# EAGLE design drum_circuits_noMIC (EAGLE 7.5.0)
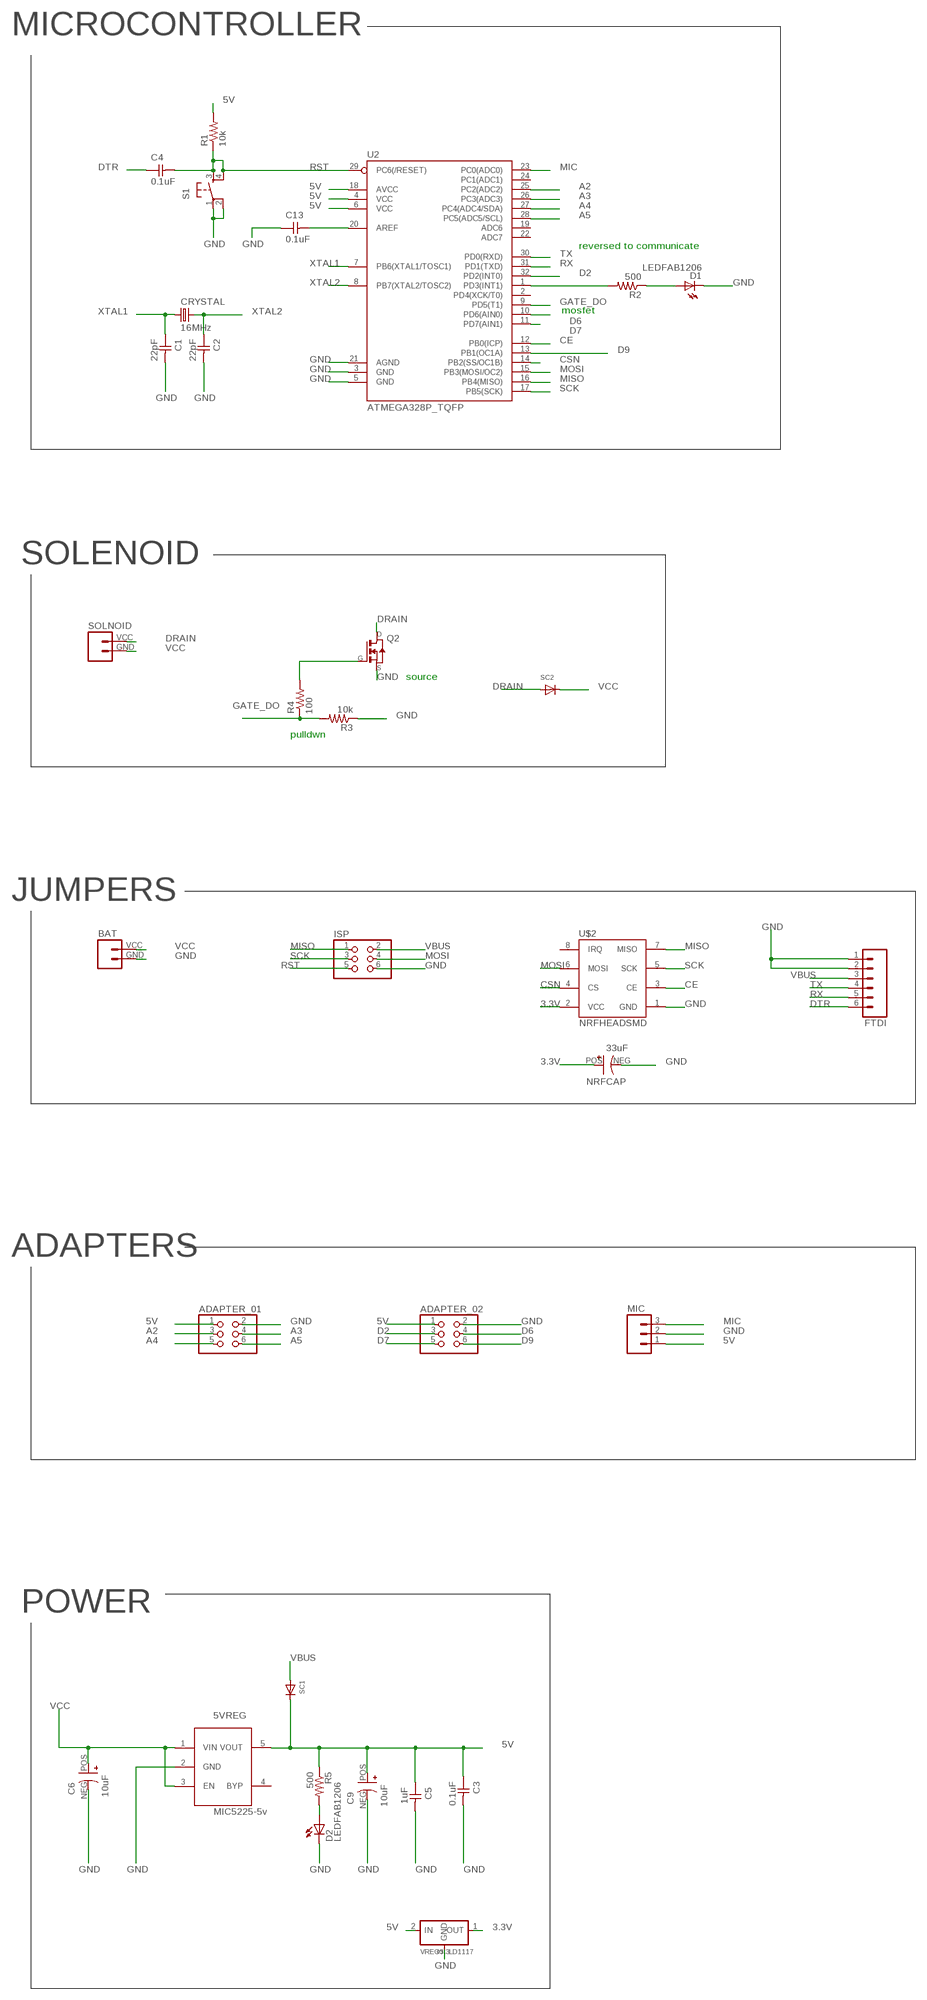
[diagram p0: schematic, sheet 1]

## Parts
5VREG  MIC5225-5v  LP298XS  [SOT23-5L]
ADAPTER_01  PINHD-2X3-SMD  [2X03SMD]
ADAPTER_02  PINHD-2X3-SMD  [2X03SMD]
BAT  M024UCON-15767  [JST-2-SMD-VERT]
C1  22pF  CAP-UNPOLARIZEDFAB  [C1206FAB]
C2  22pF  CAP-UNPOLARIZEDFAB  [C1206FAB]
C3  0.1uF  CAP-UNPOLARIZEDFAB  [C1206FAB]
C4  0.1uF  CAP-UNPOLARIZEDFAB  [C1206FAB]
C5  1uF  CAP-UNPOLARIZEDFAB  [C1206FAB]
C6  10uF  POLCAP-PANASONIC-SMD-B01  [PANASONIC-CAP-SMD-B]
C9  10uF  POLCAP-PANASONIC-SMD-B01  [PANASONIC-CAP-SMD-B]
C13  0.1uF  CAP-UNPOLARIZEDFAB  [C1206FAB]
CRYSTAL  16MHz  CRYSTAL  [2-SMD-5X3MM]
D1  LEDFAB1206  [LED1206FAB]
D2  LEDFAB1206  [LED1206FAB]
FTDI  M06SMD_MALE  [1X06_SMD_MALE]
ISP  PINHD-2X3-SMD  [2X03SMD]
MIC  M03  [JST-3-SMD]
NRFCAP  33uF  POLCAP-PANASONIC-SMD-C  [PANASONIC-CAP-SMD-C]
Q2  NMOSFETSOT23  [SOT-23]
R1  10k  RES-US1206FAB  [R1206FAB]
R2  500  RES-US1206FAB  [R1206FAB]
R3  10k  RES-US1206FAB  [R1206FAB]
R4  100  RES-US1206FAB  [R1206FAB]
R5  500  RES-US1206FAB  [R1206FAB]
S1  6MM_SWITCH6MM_SWITCH  [6MM_SWITCH]
SC1  DIODE_SOD-123FL  [SOD-123FL]
SC2  DIODE_SOD-123FL  [SOD-123FL]
SOLNOID  M024UCON-15767  [JST-2-SMD-VERT]
U2  ATMEGA328P_TQFP  [TQFP32-08]
U$2  NRFHEADSMD  [2.54MM]
VREG3.3  LD1117  REGULATORSOT23  [SOT23]

## Nets
3.3V: NRFCAP.POS(+) U$2.2(VCC) VREG3.3.1(OUT)
5V: 5VREG.5(VOUT) ADAPTER_01.1 ADAPTER_02.1 C3.1 C5.1 C9.POS(+) MIC.1 R1.2 R5.1 SC1.C U2.4(VCC) U2.6(VCC) U2.18(AVCC) VREG3.3.2(IN)
A2: ADAPTER_01.3 U2.25(PC2(ADC2))
A3: ADAPTER_01.4 U2.26(PC3(ADC3))
A4: ADAPTER_01.5 U2.27(PC4(ADC4/SDA))
A5: ADAPTER_01.6 U2.28(PC5(ADC5/SCL))
CE: U2.12(PB0(ICP)) U$2.3(CE)
CSN: U2.14(PB2(SS/OC1B)) U$2.4(CS)
D2: ADAPTER_02.3 U2.32(PD2(INT0))
D6: ADAPTER_02.4 U2.10(PD6(AIN0))
D7: ADAPTER_02.5 U2.11(PD7(AIN1))
D9: ADAPTER_02.6 U2.13(PB1(OC1A))
DRAIN: Q2.1(D) SC2.A SOLNOID.VCC
DTR: C4.1 FTDI.6
GATE_DO: R3.2 R4.1 U2.9(PD5(T1))
GND: 5VREG.2(GND) ADAPTER_01.2 ADAPTER_02.2 BAT.GND C1.2 C2.2 C3.2 C5.2 C6.NEG(-) C9.NEG(-) C13.1 D1.2(C) D2.2(C) FTDI.1 FTDI.2 ISP.6 MIC.2 NRFCAP.NEG(-) Q2.2(S) R3.1 S1.1(P) S1.2(P1) U2.3(GND) U2.5(GND) U2.21(AGND) U$2.1(GND) VREG3.3.3(GND)
MIC: MIC.3 U2.23(PC0(ADC0))
MISO: ISP.1 U2.16(PB4(MISO)) U$2.7(MISO)
MOSI: ISP.4 U2.15(PB3(MOSI/OC2)) U$2.6(MOSI)
N$1: D1.1(A) R2.1
N$6: D2.1(A) R5.2
N$9: C13.2 U2.20(AREF)
N$10: R2.2 U2.1(PD3(INT1))
N$11: Q2.3(G) R4.2
RST: C4.2 ISP.5 R1.1 S1.3(S) S1.4(S1) U2.29(PC6(/RESET))
RX: FTDI.5 U2.31(PD1(TXD))
SCK: ISP.3 U2.17(PB5(SCK)) U$2.5(SCK)
TX: FTDI.4 U2.30(PD0(RXD))
VBUS: FTDI.3 ISP.2 SC1.A
VCC: 5VREG.1(VIN) 5VREG.3(EN) BAT.VCC C6.POS(+) SC2.C SOLNOID.GND
XTAL1: C1.1 CRYSTAL.P$1 U2.7(PB6(XTAL1/TOSC1))
XTAL2: C2.1 CRYSTAL.P$2 U2.8(PB7(XTAL2/TOSC2))
Unconnected: 5VREG.4(BYP) U2.2(PD4(XCK/T0)) U2.19(ADC6) U2.22(ADC7) U2.24(PC1(ADC1)) U$2.8(IRQ)

## Notes on the sheet
- MICROCONTROLLER
- reversed to communicate
- mosfet
- SOLENOID
- source
- pulldwn
- JUMPERS
- ADAPTERS
- POWER

## Library data of the parts
5VREG = adafruit:LP298X
ADAPTER_01 ADAPTER_02 ISP = fab:PINHD-2X3-SMD: PIN HEADER
BAT SOLNOID = SparkFun-Connectors:M02: Standard 2-pin 0.1" header. Use with - straight break away headers ( PRT-00116) - right angle break away headers (PRT-00553) - swiss pins (PRT-00743) - machine pins (PRT-00117) - female headers (PRT-00115) Molex polarized connector foot print use with: PRT-08233 with associated crimp pins and housings. 2.54_SCREWTERM for use with PRT-10571. 3.5mm Screw Terminal footprints for PRT-08084 5mm Screw Terminal footprints for use with PRT-08432
C1-C5 C13 = fab:CAP-UNPOLARIZED
C6 C9 = talkingdrums:POLCAP-PANASONIC-SMD-B
CRYSTAL = fab:CRYSTAL
D1 D2 = fab:LED: LED
FTDI = SparkFun-Connectors:M06: Header 6 Standard 6-pin 0.1" header. Use with straight break away headers (SKU : PRT-00116), right angle break away headers (PRT-00553), swiss pins (PRT-00743), machine pins (PRT-00117), and female headers (PRT-00115). Molex polarized connector foot print use with SKU : PRT-08094 with associated crimp pins and housings. NOTES ON THE VARIANTS LOCK and LOCK_LONGPADS... This footprint was designed to help hold the alignment of a through-hole component (i.e. 6-pin header) while soldering it into place. You may notice that each hole has been shifted either up or down by 0.005 of an inch from it's more standard position (which is a perfectly straight line). This slight alteration caused the pins (the squares in the middle) to touch the edges of the holes. Because they are alternating, it causes a "brace" to hold the component in place. 0.005 has proven to be the perfect amount of "off-center" position when using our standard breakaway headers. Although looks a little odd when you look at the bare footprint, once you have a header in there, the alteration is very hard to notice. Also,if you push a header all the way into place, it is covered up entirely on the bottom side. This idea of altering the position of holes to aid alignment will be further integrated into the Sparkfun Library for other footprints. It can help hold any component with 3 or more connection pins.; PROD_ID: CONN-11293
MIC = SparkFun:M03: Header 3 Standard 3-pin 0.1" header. Use with straight break away headers (SKU : PRT-00116), right angle break away headers (PRT-00553), swiss pins (PRT-00743), machine pins (PRT-00117), and female headers (PRT-00115). Molex polarized connector foot print use with SKU : PRT-08232 with associated crimp pins and housings.
NRFCAP = talkingdrums:POLCAP-PANASONIC-SMD-C
Q2 = fab:NMOSFET: MOS FET
R1-R5 = fab:RES-US: Resistor (US Symbol) Variants with postfix FAB are widened to allow the routing of internal traces
S1 = fab:6MM_SWITCH: OMRON SWITCH
SC1 SC2 = adafruit:DIODE: Diode SMADIODE - SMA Surface Mount Package 20V 1A Schottky Diode Digikey: 641-1014-6-ND DO-1N4148 - Through Hole Small Current Diode SOD-123 20V 1 A (.5mV Vf) Schottky Diode - Digikey: MBRX120TPMSCT-ND SOD-323 10V 570mA (.38mV Vf, 3ns) Schottky Diode - Digikey: ZLLS410CT-ND SOD-523 30V 30mA Schottky Diode (RB751S-40TE61) - Digikey: RB751S-40TE61CT-ND SOT23-R/W - SOT23 Package (R = Solder Paste/Reflow Ovens, W = Hand-Soldering) BAT54Film 40V 300mA - Digikey: 497-7162-1-ND
U2 = SparkFun-DigitalIC:ATMEGA328P_TQFP; PROD_ID: IC-09069
U$2 = nrf:NRFHEAD
VREG3.3 = fab:REGULATOR

## Board
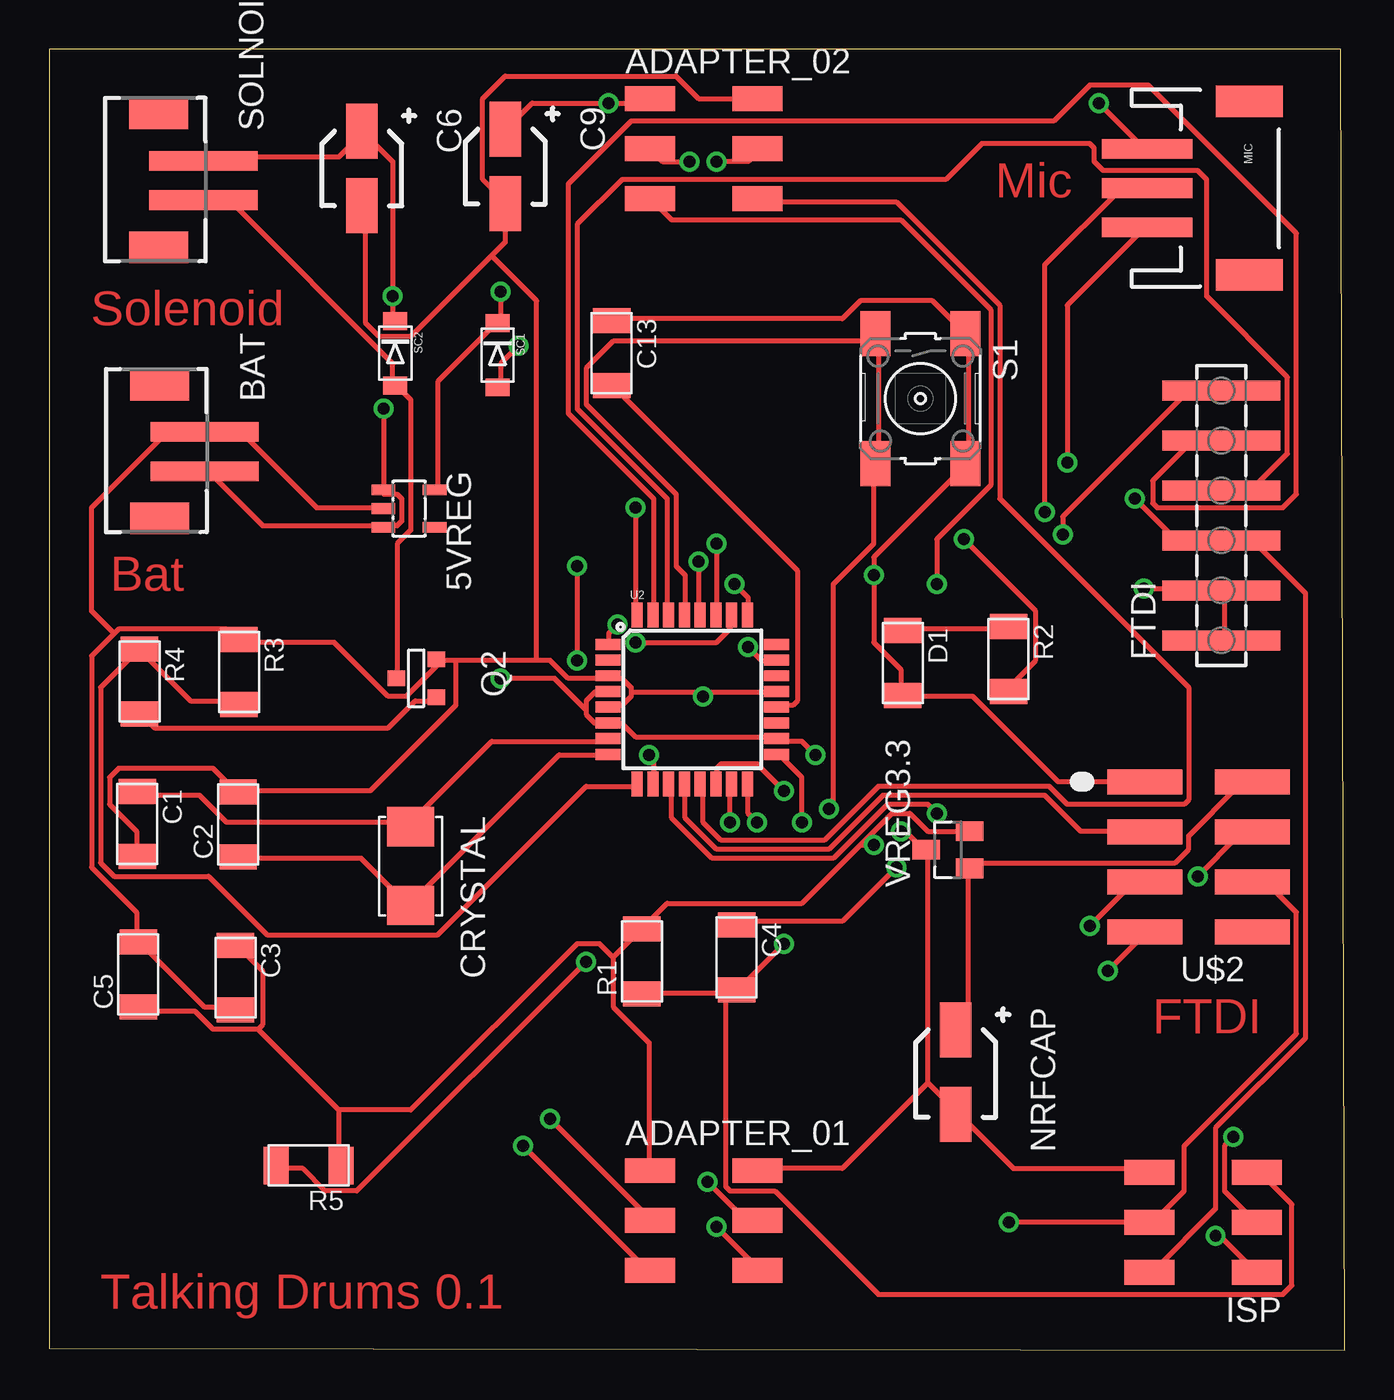
[diagram p1: board, top side]
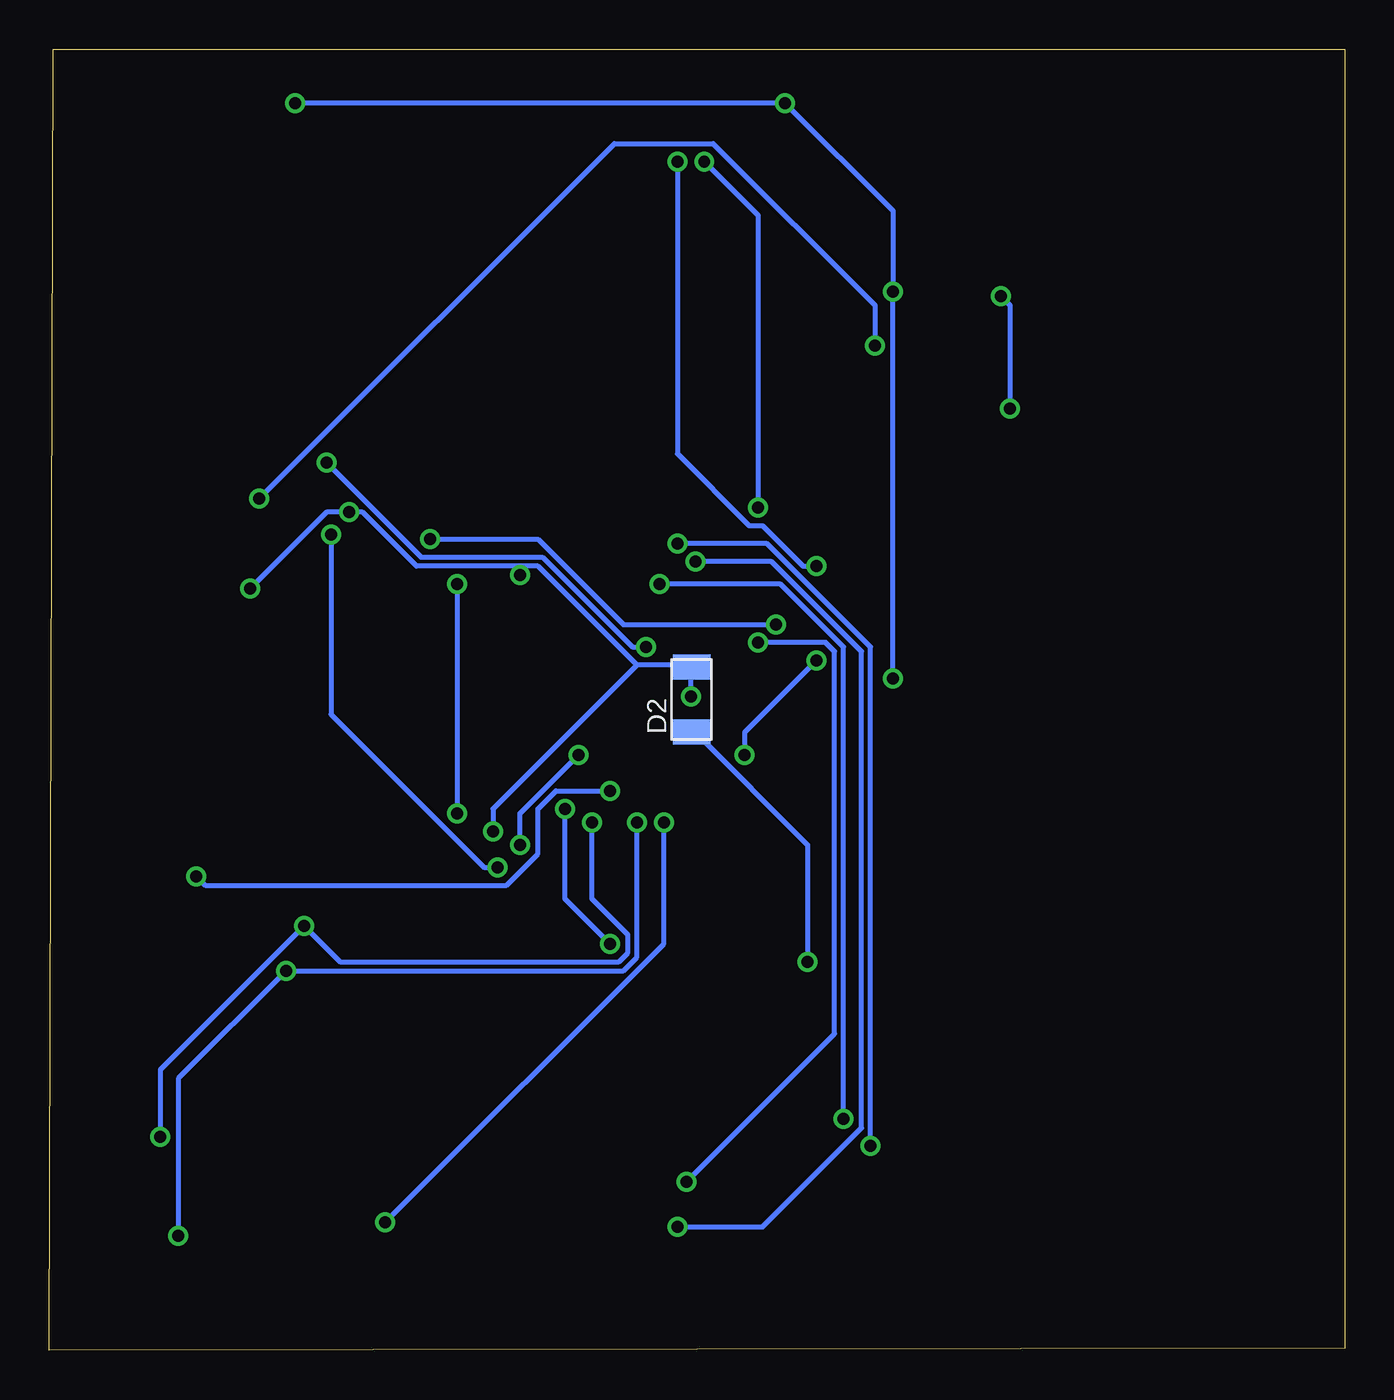
[diagram p2: board, bottom side, seen from below]

Size 65.87 x 66.16 mm. Coordinates in mm from the lower left corner, seen from the top.
Outline: 0,0.1 65.87,0 65.67,66.16 0,66.16 0,0.1
Copper layers (1*16): Top 0.035mm / dielectric 1.5mm / Bottom 0.035mm
Design rules "default": minimum track width 10mil, minimum drill 24mil, track to track 8mil, track to pad 8mil, pad to pad 8mil, via to via 8mil, smd to smd 8mil, copper to edge 40mil, drill to drill 8mil, minimum pad ring 10mil, minimum via ring 8mil, stop-mask expansion 4mil, vias tented up to drill 0mil, thermal gap 10mil

### Footprints (pad centres in the part's own frame; a part is rotated, then mirrored left to right if it is on the bottom)
SOT23-5L = smd 0.55 x 1.2: 1 -0.95,-1.3; 2 0,-1.3; 3 0.95,-1.3; 4 0.95,1.3; 5 -0.95,1.3
2X03SMD = smd 2.54 x 1.27: 1 -2.54,2.54; 2 2.92,2.54; 3 -2.54,0; 4 2.92,0; 5 -2.54,-2.54; 6 2.92,-2.54
JST-2-SMD-VERT = smd 1 x 5.5: GND 1,-2; VCC -1,-2 | smd 1.6 x 3: P$1 -3.4,0.27; P$2 3.4,0.27
C1206FAB = smd 1.27 x 1.905: 1 -1.651,0; 2 1.651,0
PANASONIC-CAP-SMD-B = smd 1.6 x 2.794: NEG 0,3.794; POS 0,0
2-SMD-5X3MM = smd 2 x 2.4: P$1 -2,0; P$2 2,0
LED1206FAB = smd 1.27 x 1.905: 1 -1.651,0; 2 1.651,0
1X06_SMD_MALE = smd 1.02 x 6: 1 0,0; 2 2.54,0; 3 5.08,0; 4 7.62,0; 5 10.16,0; 6 12.7,0
JST-3-SMD = smd 1 x 4.6: 1 -1.99,-4.77; 2 0.01,-4.77; 3 2.01,-4.77 | smd 1.6 x 3.4: NC1 -4.39,0.43; NC2 4.41,0.43
PANASONIC-CAP-SMD-C = smd 1.6 x 2.794: NEG 0,4.294; POS 0,0
SOT-23 = smd 0.787 x 0.889: 1 0.025,-1.016; 2 -0.94,1.016; 3 0.991,1.016
R1206FAB = smd 1.27 x 1.905: 1 -1.651,0; 2 1.651,0
6MM_SWITCH = smd 2.286 x 1.524: 1 -3.302,2.286; 2 3.302,2.286; 3 -3.302,-2.286; 4 3.302,-2.286
SOD-123FL = smd 0.91 x 1.22: A 1.637,0; C -1.637,0
TQFP32-08 = smd 1.27 x 0.559: 1 -4.293,2.8; 2 -4.293,2; 3 -4.293,1.2; 4 -4.293,0.4; 5 -4.293,-0.4; 6 -4.293,-1.2; 7 -4.293,-2; 8 -4.293,-2.8; 17 4.293,-2.8; 18 4.293,-2; 19 4.293,-1.2; 20 4.293,-0.4; 21 4.293,0.4; 22 4.293,1.2; 23 4.293,2; 24 4.293,2.8 | smd 0.559 x 1.27: 9 -2.8,-4.293; 10 -2,-4.293; 11 -1.2,-4.293; 12 -0.4,-4.293; 13 0.4,-4.293; 14 1.2,-4.293; 15 2,-4.293; 16 2.8,-4.293; 25 2.8,4.293; 26 2,4.293; 27 1.2,4.293; 28 0.4,4.293; 29 -0.4,4.293; 30 -1.2,4.293; 31 -2,4.293; 32 -2.8,4.293
2.54MM = smd 3.81 x 1.27: 1 0,0; 2 -5.486,0; 3 0,2.54; 4 -5.486,2.54; 5 0,5.08; 6 -5.486,5.08; 7 0,7.62; 8 -5.486,7.62
SOT23 = smd 1 x 1.4: 1 -0.95,-1.1; 2 0.95,-1.1; 3 0,1.1

### Placement (x,y rotation side)
5VREG  18.3,42.8 270 top
ADAPTER_01  33.1,6.6 0 top
ADAPTER_02  33.1,61.1 0 top
BAT  5.9,45.7 90 top
C1  4.48,26.76 270 top
C2  9.61,26.74 90 top
C3  9.48,18.95 270 top
C4  34.95,19.99 270 top
C5  4.53,19.11 90 top
C6  15.9,62 180 top
C9  23.2,62.1 180 top
C13  28.6,50.7 270 top
CRYSTAL  18.38,24.62 270 top
D1  43.41,34.95 270 top
D2  33.2,33.1 90 bottom
FTDI  59.6,36.1 90 top
ISP  58.86,6.5 180 top
MIC  60.6,59.1 270 top
NRFCAP  46.1,16.3 180 top
Q2  18.66,34.19 270 top
R1  30.14,19.78 90 top
R2  48.78,35.14 270 top
R3  9.66,34.48 270 top
R4  4.6,34 270 top
R5  13.2,9.4 180 top
S1  44.3,48.4 270 top
SC1  22.8,50.6 270 top
SC2  17.6,50.7 270 top
SOLNOID  5.84,59.48 90 top
U2  32.7,33.1 0 top
U$2  55.7,28.9 180 top
VREG3.3  45.7,25.45 90 top

### Tracks (layer width: path | path; a pad name or v marks a point on that pad's centre or on a via)
3.3V
  Top 0.254: NRFCAP.POS 46.28,16.33 46.73,16.79 46.73,24.33 VREG3.3.1 46.96,24.56 47.19,24.79 57.25,24.79 57.94,25.48 57.94,26.16 60.45,28.68 61.14,28.68 U$2.2
5V  (via drill 0.61)
  Top 0.254: 5VREG.5 19.76,43.76 19.76,49.25 22.73,52.22 SC1.C 22.96,52.45 v22.96,53.82 | ADAPTER_02.1 30.5,63.42 v28.45,63.42 24.56,63.42 23.42,62.28 C9.POS | v53.36,63.42 55.65,61.14 MIC.1 | 10.62,16.33 8.33,16.33 7.42,17.25 4.67,17.25 C5.1 | 10.62,16.33 10.84,16.56 10.84,19.3 9.7,20.45 C3.1 | 14.73,12.22 14.73,9.47 R5.1 | 10.62,16.33 14.73,12.22 | 27.3,32.56 27.3,33.02 27.76,33.48 28.22,33.48 U2.4 | 27.3,32.56 27.3,32.33 27.76,31.88 28.22,31.88 U2.6 28.45,31.88 29.13,31.88 29.82,31.19 36.91,31.19 U2.18 37.13,30.96 38.28,30.96 v38.96,30.28 | 41.25,25.7 38.28,22.73 31.42,22.73 30.28,21.59 R1.2 30.05,21.36 28.68,19.99 | 41.25,25.7 42.85,27.3 43.76,27.3 44.68,26.39 46.73,26.39 VREG3.3.2 | 28.68,19.99 28.68,17.47 30.5,15.64 30.5,9.24 ADAPTER_01.1 | 41.25,25.7 v41.93,25.7 | 14.73,12.22 18.39,12.22 26.85,20.67 27.99,20.67 28.68,19.99 | v22.96,34.16 25.7,34.16 27.3,32.56
  Bottom 0.254: v53.36,63.42 v28.45,63.42 22.96,57.94 v22.96,53.82 v22.96,34.16 | v38.96,30.28 41.93,27.3 v41.93,25.7
A2  (via drill 0.61)
  Top 0.254: v34.85,38.96 35.53,38.28 35.53,37.59 U2.25 | v25.48,11.76 30.5,6.73 ADAPTER_01.3
  Bottom 0.254: v34.85,38.96 28.68,38.96 25.48,35.76 v25.48,11.76
A3  (via drill 0.61)
  Top 0.254: v29.82,35.99 33.93,35.99 34.62,36.68 34.62,37.36 U2.26 | v33.48,8.56 35.3,6.73 35.99,6.73 ADAPTER_01.4
  Bottom 0.254: v29.82,35.99 26.39,35.99 25.93,35.53 25.93,16.1 v33.48,8.56
A4  (via drill 0.61)
  Top 0.254: v33.93,41.02 33.93,37.59 U2.27 | v24.1,10.39 30.5,3.99 ADAPTER_01.5
  Bottom 0.254: v33.93,41.02 29.36,41.02 24.1,35.76 v24.1,10.39
A5  (via drill 0.61)
  Top 0.254: v33.02,40.11 33.02,37.59 U2.28 | v33.93,6.27 35.99,4.21 ADAPTER_01.6
  Bottom 0.254: v33.02,40.11 29.13,40.11 24.56,35.53 24.56,11.3 29.59,6.27 v33.93,6.27
CE
  Top 0.254: U2.12 32.33,28.68 32.33,27.08 33.93,25.48 39.65,25.48 42.39,28.22 50.62,28.22 52.45,26.39 55.65,26.39 U$2.3
CSN  (via drill 0.61)
  Top 0.254: v37.36,28.45 35.99,29.82 34.16,29.82 33.93,29.59 33.93,28.9 U2.14 | v58.39,24.1 60.45,26.16 61.14,26.16 U$2.4
  Bottom 0.254: v37.36,28.45 40.11,28.45 41.02,27.53 41.02,25.25 42.62,23.65 57.94,23.65 v58.39,24.1
D2  (via drill 0.61)
  Top 0.254: v29.82,42.85 29.82,37.59 U2.32 | v32.56,60.45 31.19,60.45 30.73,60.91 ADAPTER_02.3
  Bottom 0.254: v29.82,42.85 29.82,57.71 v32.56,60.45
D6  (via drill 0.61)
  Top 0.254: v30.5,30.28 30.73,30.05 30.73,28.9 U2.10 | v26.85,39.88 v26.85,35.08 | v33.93,60.45 35.53,60.45 35.99,60.91 ADAPTER_02.4
  Bottom 0.254: v30.5,30.28 30.5,31.42 v26.85,35.08 | v26.85,39.88 27.53,39.88 29.59,41.93 30.28,41.93 33.93,45.59 v33.93,60.45
D7  (via drill 0.61)
  Top 0.254: v45.13,27.3 44.68,27.76 42.62,27.76 39.88,25.02 33.7,25.02 31.65,27.08 31.65,28.68 U2.11 | v45.13,38.96 45.13,41.25 47.88,43.99 47.88,52.91 43.3,57.48 31.65,57.48 30.73,58.39 ADAPTER_02.5
  Bottom 0.254: v45.13,38.96 v45.13,27.3
D9
  Top 0.254: U2.13 33.25,28.68 33.25,26.85 34.16,25.93 39.42,25.93 42.16,28.68 50.85,28.68 51.76,27.76 57.71,27.76 57.94,27.99 57.94,33.7 48.34,43.3 48.34,53.13 43.08,58.39 36.22,58.39 ADAPTER_02.6
DRAIN
  Top 0.254: Q2.1 17.7,34.39 17.7,41.02 18.39,41.7 18.39,48.34 17.7,49.02 SC2.A 17.47,49.25 17.47,50.16 9.24,58.39 7.87,58.39 SOLNOID.VCC
DTR  (via drill 0.61)
  Top 0.254: v43.08,24.56 40.33,21.82 35.08,21.82 C4.1 | v51.54,41.48 51.54,42.39 57.94,48.79 59.54,48.79 FTDI.6
  Bottom 0.254: v43.08,24.56 43.76,24.56 51.54,32.33 v51.54,41.48
GATE_DO
  Top 0.254: U2.9 29.82,28.68 27.3,28.68 19.76,21.13 11.07,21.13 8.1,24.1 3.3,24.1 2.62,24.79 2.62,33.7 4.44,35.53 R4.1 4.67,35.53 7.19,33.02 9.47,33.02 R3.2
GND  (via drill 0.61)
  Top 0.254: U$2.1 55.65,28.9 51.31,28.9 46.96,33.25 43.53,33.25 D1.2 43.3,33.48 43.3,34.62 41.93,35.99 v41.93,39.42 41.93,40.33 46.51,44.91 S1.2 46.73,45.13 46.73,51.54 S1.1 46.51,51.76 44.91,53.36 41.25,53.36 40.33,52.45 28.68,52.45 C13.1 | 44.68,13.59 44.68,25.25 VREG3.3.3 44.45,25.48 43.53,26.39 v43.3,26.39 | 44.68,13.59 46.05,12.22 NRFCAP.NEG 46.28,11.99 49.02,9.24 55.88,9.24 ISP.6 | 44.68,13.59 40.33,9.24 36.22,9.24 ADAPTER_01.2 | ADAPTER_02.2 35.99,63.65 33.02,63.65 31.88,64.79 23.19,64.79 22.05,63.65 22.05,59.54 23.19,58.39 C9.NEG 23.19,58.16 23.19,56.34 22.5,55.65 | 22.5,55.65 18.39,51.54 16.79,51.54 16.1,52.22 16.1,58.16 C6.NEG | 5VREG.2 16.79,42.85 13.59,42.85 9.93,46.51 8.1,46.51 BAT.GND 7.87,46.51 5.81,46.51 2.16,42.85 2.16,37.59 3.3,36.45 | FTDI.1 59.77,36.22 59.77,38.51 FTDI.2 59.54,38.73 v55.65,38.73 | C1.2 4.44,25.25 4.44,26.39 3.07,27.76 3.07,29.13 3.53,29.59 8.33,29.59 9.47,28.45 C2.2 9.7,28.45 16.33,28.45 20.67,32.79 20.67,35.08 | C3.2 9.47,17.47 7.87,17.47 4.67,20.67 C5.2 4.44,20.9 4.44,22.27 2.16,24.56 2.16,35.3 3.3,36.45 | 24.79,35.08 25.48,35.08 26.39,34.16 28.22,34.16 U2.3 28.45,34.16 29.13,34.16 29.59,33.7 29.59,33.48 | 24.79,35.08 20.67,35.08 | 20.67,35.08 19.99,35.08 | 19.99,35.08 19.76,35.08 Q2.2 19.99,35.08 | 29.59,33.48 29.59,33.25 29.13,32.79 28.45,32.79 U2.5 | 29.59,33.48 33.25,33.48 | 33.25,33.48 36.91,33.48 U2.21 | 33.25,33.48 v33.25,33.25 | 19.99,35.08 18.16,33.25 17.25,33.25 14.5,35.99 9.7,35.99 R3.1 9.47,36.22 9.01,36.68 3.53,36.68 3.3,36.45 | v50.62,42.62 50.62,55.19 54.51,59.08 55.65,59.08 MIC.2 | 22.5,55.65 24.79,53.36 24.79,35.08
  Bottom 0.254: v33.25,33.25 33.25,34.62 D2.2 33.25,34.85 35.99,34.85 | 41.93,39.88 41.02,39.88 35.99,34.85 | 41.93,39.88 47.19,39.88 49.94,42.62 v50.62,42.62 51.76,42.62 v55.65,38.73 | v43.3,26.39 43.3,27.53 35.99,34.85 | 41.93,39.88 v41.93,39.42
MIC  (via drill 0.61)
  Top 0.254: v35.53,35.76 36.22,35.08 36.91,35.08 U2.23 | v51.76,45.13 51.76,53.13 55.65,57.02 MIC.3
  Bottom 0.254: v35.53,35.76 36.22,35.76 40.79,40.33 46.96,40.33 v51.76,45.13
MISO  (via drill 0.61)
  Top 0.254: v35.99,26.85 35.53,27.3 35.53,28.68 U2.16 | v53.82,19.3 55.65,21.13 U$2.7 | v59.31,5.81 59.54,5.81 61.37,3.99 ISP.1
  Bottom 0.254: v35.99,26.85 35.99,19.99 36.68,19.3 v53.82,19.3 59.31,13.82 v59.31,5.81
MOSI  (via drill 0.61)
  Top 0.254: v34.62,26.85 34.62,28.68 U2.15 | v48.79,6.5 55.88,6.5 ISP.4 56.11,6.5 57.71,8.1 57.71,10.39 63.42,16.1 63.42,22.27 62.05,23.65 61.37,23.65 U$2.6
  Bottom 0.254: v34.62,26.85 34.62,20.67 v48.79,6.5
N$1
  Top 0.254: D1.1 43.53,36.68 48.56,36.68 R2.1
N$6  (via drill 0.61)
  Top 0.254: v27.3,19.76 15.64,8.1 14.04,8.1 12.9,9.24 11.76,9.24 R5.2
  Bottom 0.254: v27.3,19.76 27.3,25.7 33.02,31.42 D2.1
N$9
  Top 0.254: U2.20 37.13,32.79 37.82,32.79 38.05,33.02 38.05,39.65 28.68,49.02 C13.2
N$10  (via drill 0.61)
  Top 0.254: v28.9,36.91 28.45,36.45 28.45,35.99 U2.1 | v46.51,41.25 50.16,37.59 50.16,35.08 48.79,33.7 R2.2
  Bottom 0.254: v28.9,36.91 36.68,36.91 41.02,41.25 v46.51,41.25
N$11
  Top 0.254: Q2.3 19.53,33.02 18.62,33.02 17.25,31.65 5.36,31.65 4.67,32.33 R4.2
RST  (via drill 0.61)
  Top 0.254: U2.29 32.33,37.59 32.33,39.42 31.88,39.88 31.88,43.53 27.3,48.11 27.3,49.94 28.68,51.31 41.7,51.31 41.93,51.54 S1.3 42.16,51.54 42.16,45.13 S1.4 41.93,44.91 41.93,41.02 39.88,38.96 39.88,27.76 v39.65,27.53 | 34.39,18.16 34.85,18.16 C4.2 | 34.39,18.16 30.28,18.16 R1.1 | 34.39,18.16 34.39,8.33 34.62,8.1 36.91,8.1 42.16,2.84 62.74,2.84 63.19,3.3 63.19,7.42 61.59,9.01 ISP.5 | 34.39,18.16 C4.2 | v37.36,20.67 35.08,18.39 C4.2
  Bottom 0.254: v39.65,27.53 39.65,22.96 v37.36,20.67
RX
  Top 0.254: U2.31 30.73,37.59 30.73,43.3 26.39,47.65 26.39,59.31 29.59,62.51 51.08,62.51 52.91,64.34 55.88,64.34 63.42,56.79 63.42,43.53 62.74,42.85 56.34,42.85 56.11,43.08 56.11,44.22 57.94,46.05 59.54,46.05 FTDI.5
SCK  (via drill 0.61)
  Top 0.254: v38.28,26.85 38.28,29.13 37.13,30.28 U2.17 | v52.91,21.59 54.96,23.65 55.65,23.65 U$2.5 | v60.22,10.84 59.77,10.39 59.77,8.1 61.37,6.5 ISP.3
  Bottom 0.254: v38.28,26.85 38.28,22.96 36.45,21.13 36.45,20.22 36.91,19.76 51.08,19.76 v52.91,21.59 60.22,14.27 v60.22,10.84
TX
  Top 0.254: U2.30 31.42,37.59 31.42,43.3 26.85,47.88 26.85,57.25 29.13,59.54 45.59,59.54 47.42,61.37 52.91,61.37 53.13,61.14 53.13,60.45 53.59,59.99 58.39,59.99 58.85,59.54 58.85,53.59 62.97,49.48 62.97,45.59 61.14,43.76 59.77,43.76 FTDI.4
VBUS  (via drill 0.61)
  Top 0.254: v23.87,51.08 22.96,50.16 22.96,49.02 SC1.A | v55.19,43.3 57.25,41.25 59.54,41.25 FTDI.3 59.77,41.02 61.37,41.02 63.88,38.51 63.88,15.87 59.31,11.3 59.31,7.19 56.11,3.99 ISP.2
  Bottom 0.254: v23.87,51.08 23.87,53.13 32.1,61.37 37.13,61.37 v55.19,43.3
VCC  (via drill 0.61)
  Top 0.254: BAT.VCC 8.1,44.68 10.84,41.93 16.79,41.93 5VREG.3 17.02,41.93 17.7,41.93 17.93,42.16 17.93,43.3 17.7,43.53 17.02,43.53 5VREG.1 17.02,43.76 v17.02,47.88 | SC2.C 17.47,52.45 v17.47,53.59 17.47,60.45 16.1,61.82 C6.POS 15.87,61.82 14.73,60.68 7.87,60.68 SOLNOID.GND
  Bottom 0.254: v17.02,47.88 17.02,53.13 v17.47,53.59
XTAL1
  Top 0.254: U2.7 28.22,30.96 22.5,30.96 18.39,26.85 CRYSTAL.P$1 18.16,26.85 9.01,26.85 7.64,28.22 4.67,28.22 C1.1
XTAL2
  Top 0.254: U2.8 28.22,30.28 25.93,30.28 18.39,22.73 CRYSTAL.P$2 18.16,22.73 15.87,25.02 9.7,25.02 C2.1

### Text on the board
Top: Mic | Solenoid | Bat | FTDI | Talking Drums 0.1